# EAGLE design RGB_SMD (EAGLE 6.5.0)
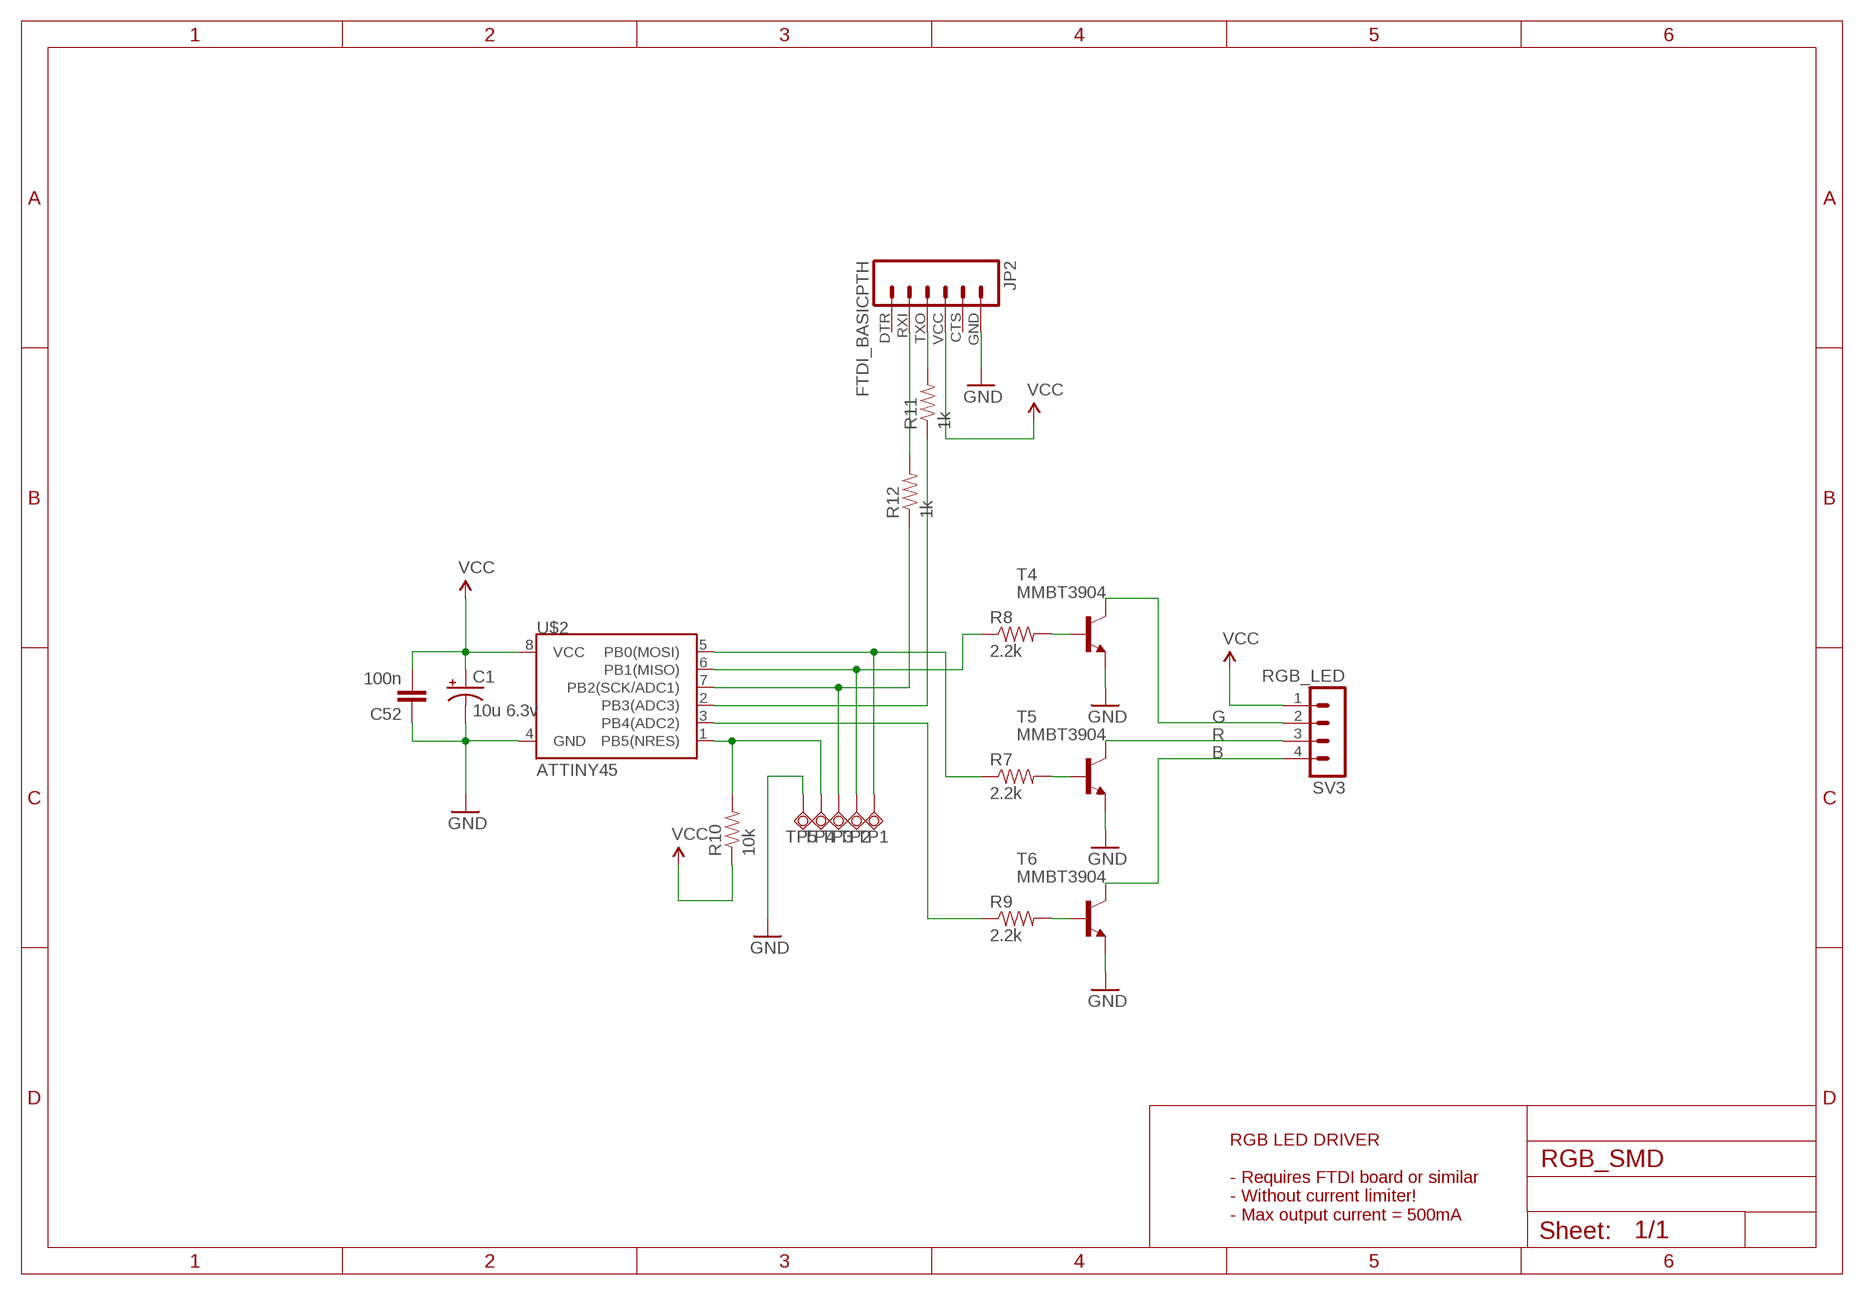
[diagram p0: schematic, sheet 1]

## Parts
C1  10u 6.3v  CAP_POL1206  [EIA3216]
C52  100n  CAP0805  [0805]
JP2  FTDI_BASICPTH  [FTDI_BASIC]
R7  2.2k  RESISTOR0805-RES  [0805]
R8  2.2k  RESISTOR0805-RES  [0805]
R9  2.2k  RESISTOR0805-RES  [0805]
R10  10k  RESISTOR0805-RES  [0805]
R11  1k  RESISTOR0805-RES  [0805]
R12  1k  RESISTOR0805-RES  [0805]
SV3  RGB_LED  MA04-1  [MA04-1]
T4  MMBT3904  MMBT3904LT1-NPN-SOT23-BEC  [SOT23-BEC]
T5  MMBT3904  MMBT3904LT1-NPN-SOT23-BEC  [SOT23-BEC]
T6  MMBT3904  MMBT3904LT1-NPN-SOT23-BEC  [SOT23-BEC]
TP1  TPSQTP16SQ  [TP16SQ]
TP2  TPSQTP16SQ  [TP16SQ]
TP3  TPSQTP16SQ  [TP16SQ]
TP4  TPSQTP16SQ  [TP16SQ]
TP5  TPSQTP16SQ  [TP16SQ]
U$2  ATTINY45  [SO08-EIAJ]

## Nets
B: SV3.4 T6.C
G: SV3.2 T4.C
GND: C1.C(-) C52.1 JP2.GND T4.E T5.E T6.E TP5.TP U$2.4(GND)
N$12: JP2.TXO R11.2
N$13: JP2.RXI R12.2
N$14: R10.2 TP4.TP U$2.1(PB5(NRES))
N$15: R11.1 U$2.2(PB3(ADC3))
N$16: R12.1 TP3.TP U$2.7(PB2(SCK/ADC1))
N$17: R7.1 TP1.TP U$2.5(PB0(MOSI))
N$18: R8.1 TP2.TP U$2.6(PB1(MISO))
N$19: R9.1 U$2.3(PB4(ADC2))
N$20: R9.2 T6.B
N$21: R7.2 T5.B
N$22: R8.2 T4.B
R: SV3.3 T5.C
VCC: C1.A(+) C52.2 JP2.VCC R10.1 SV3.1 U$2.8(VCC)
Unconnected: JP2.CTS JP2.DTR

## Notes on the sheet
- RGB LED DRIVER
  
  - Requires FTDI board or similar
  - Without current limiter!
  - Max output current = 500mA

## Library data of the parts
C1 = SparkFun:CAP_POL: Capacitor Polarized These are standard SMD and PTH capacitors. Normally 10uF, 47uF, and 100uF in electrolytic and tantalum varieties. Always verify the external diameter of the through hole cap, it varies with capacity, voltage, and manufacturer. The EIA devices should be standard.
C52 = SparkFun:CAP: Capacitor Standard 0603 ceramic capacitor, and 0.1" leaded capacitor.
JP2 = SparkFun:FTDI_BASIC: FTDI Basic: 3.3V and 5V
R7-R12 = SparkFun:RESISTOR: Resistor Basic schematic elements and footprints for 0603, 1206, and PTH resistors.
SV3 = con-lstb:MA04-1: PIN HEADER; OC_FARNELL: unknown; OC_NEWARK: unknown
T4-T6 = transistor-neu-to92:*-NPN-: NPN Transistror
TP1-TP5 = testpad:TPSQ: Test pad
U$2 = SparkFun:ATTINY45: Atmel ATTiny45

## Net classes
0 default: width 0.3 mm
4 GND: width 0.3 mm

## Board
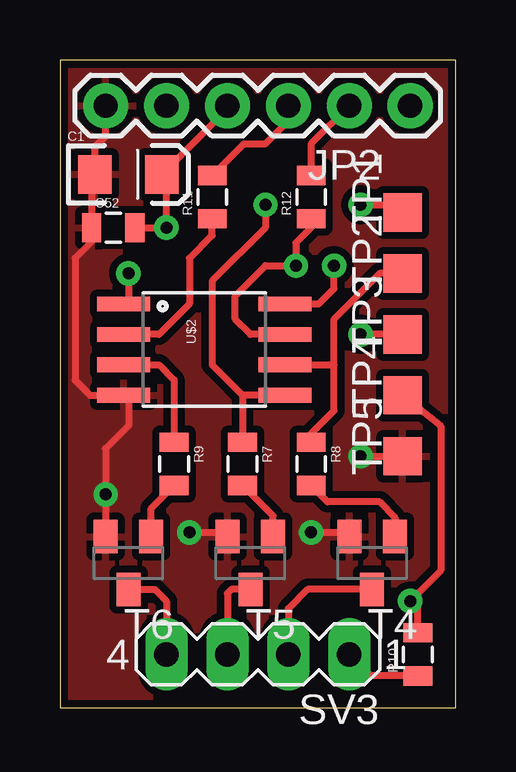
[diagram p1: board, top side]
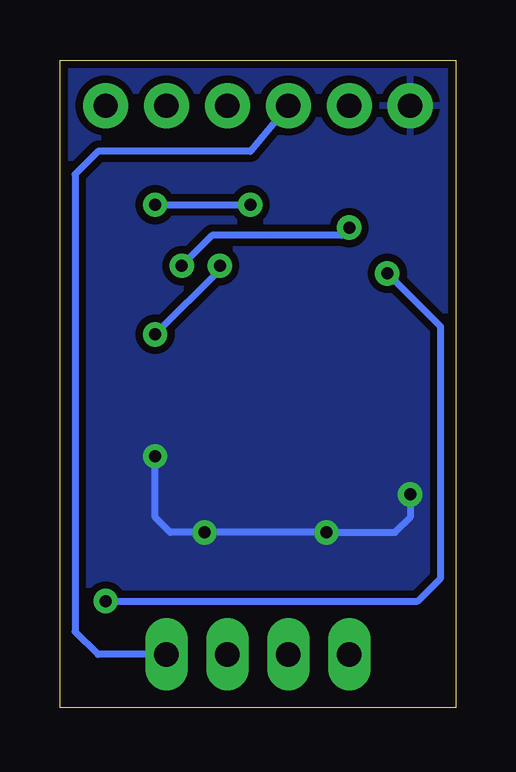
[diagram p2: board, bottom side, seen from below]

Size 16.51 x 26.99 mm. Coordinates in mm from the lower left corner, seen from the top.
Outline: 16.51,26.99 0,26.99 0,0 16.51,0 16.51,26.99
Copper layers (1*16): Top 0.035mm / dielectric 1.5mm / Bottom 0.035mm
Design rules "DROPES_fuse *": minimum track width 0.3mm, minimum drill 0.5mm, track to track 0.3mm, track to pad 0.3mm, pad to pad 0.3mm, via to via 0.3mm, smd to smd 0.3mm, copper to edge 0.3mm, drill to drill 8mil, minimum pad ring 15mil, minimum via ring 8mil, stop-mask expansion 4mil, vias tented up to drill 0mil, thermal gap 0.3mm

### Footprints (pad centres in the part's own frame; a part is rotated, then mirrored left to right if it is on the bottom)
EIA3216 = smd 1.4 x 1.6: A 1.4,0; C -1.4,0
0805 = smd 0.8 x 1.2: 1 -0.9,0; 2 0.9,0
FTDI_BASIC = drill 1.016 pad 1.88: CTS 10.16,0; DTR 0,0; GND 12.7,0; RXI 2.54,0; TXO 5.08,0; VCC 7.62,0
MA04-1 = drill 1.016 long: 1 -3.81,0; 2 -1.27,0; 3 1.27,0; 4 3.81,0
SOT23-BEC = smd 1 x 1.4: B -0.95,-1.1; C 0,1.1; E 0.95,-1.1
TP16SQ = smd 1.6 x 1.6: TP 0,0
SO08-EIAJ = smd 0.61 x 2.21: 1 -1.905,-3.378; 2 -0.635,-3.378; 3 0.635,-3.378; 4 1.905,-3.378; 5 1.905,3.353; 6 0.635,3.353; 7 -0.635,3.353; 8 -1.905,3.353

### Placement (x,y rotation side)
C1  2.86,22.23 0 top
C52  2.22,20 0 top
JP2  14.61,25.08 180 top
R7  7.62,10.16 270 top
R8  10.48,10.16 270 top
R9  4.76,10.16 270 top
R10  14.92,2.22 90 top
R11  6.35,21.27 90 top
R12  10.48,21.27 90 top
SV3  8.25,2.22 180 top
T4  13.02,6.03 180 top
T5  7.94,6.03 180 top
T6  2.86,6.03 180 top
TP1  14.29,20.64 90 top
TP2  14.29,18.1 90 top
TP3  14.29,15.56 90 top
TP4  14.29,13.02 90 top
TP5  14.29,10.48 90 top
U$2  6.03,14.92 270 top

### Tracks (layer width: path | path; a pad name or v marks a point on that pad's centre or on a via)
B
  Top 0.3: T6.C 3.96,4.93 4.44,4.45 SV3.4
G
  Top 0.3: T4.C 10.33,4.93 9.52,4.13 SV3.2
GND  (via drill 0.5 pad 1.02)
  Top 0.3: v5.4,7.3 6.67,7.3 T5.E | v10.48,7.3 11.75,7.3 T4.E | 1.59,7.3 T6.E v1.9,8.89 1.9,10.79 2.86,11.75 2.86,13.02 U$2.4 1.27,13.02 0.63,13.65 0.63,18.73 1.32,19.42 C52.1 | v12.54,10.48 TP5.TP | JP2.GND 1.89,23.8 1.46,23.36 C1.C 1.32,22.09 C52.1 | 1.26,19.75 C52.1
  Bottom 0.3: v12.54,10.48 12.54,7.94 11.91,7.3 v10.48,7.3 v5.4,7.3 2.54,7.3 1.9,7.94 v1.9,8.89
  pour Top: 0,0 0,26.99 16.51,26.99 16.51,0
  pour Bottom: 0,0 0,26.99 16.51,26.99 16.51,0
N$12
  Top 0.3: R11.2 7.67,23.49 8.57,23.49 9.52,24.45 JP2.TXO
N$13
  Top 0.3: JP2.RXI 10.48,23.49 R12.2
N$14  (via drill 0.5 pad 1.02)
  Top 0.3: TP4.TP 15.88,11.75 15.88,5.71 v14.61,4.45 14.92,4.13 R10.2 | v2.86,18.1 2.86,17.03 U$2.1
  Bottom 0.3: v14.61,4.45 1.59,4.45 0.63,5.4 0.63,15.87 v2.86,18.1
N$15
  Top 0.3: U$2.2 4.13,15.56 5.4,16.83 5.4,18.73 6.35,19.68 R11.1
N$16  (via drill 0.5 pad 1.02)
  Top 0.3: U$2.7 7.94,15.56 7.3,16.19 7.3,17.14 8.57,18.42 v9.84,18.42 9.84,19.37 10.48,20 R12.1 | TP3.TP v12.54,15.56
  Bottom 0.3: v9.84,18.42 9.84,18.26 v12.54,15.56
N$17  (via drill 0.5 pad 1.02)
  Top 0.3: 9.21,13.02 U$2.5 7.62,13.02 | 7.62,13.02 6.35,14.29 6.35,17.78 8.57,20 v8.57,20.96 | 7.62,13.02 R7.1 | v12.54,20.96 13.97,20.96 TP1.TP
  Bottom 0.3: v12.54,20.96 v8.57,20.96
N$18
  Top 0.3: U$2.6 11.43,14.29 | R8.1 10.16,11.11 11.43,12.38 11.43,14.29 | 11.43,14.29 11.43,16.19 13.33,18.1 TP2.TP
N$19
  Top 0.3: U$2.3 4.13,14.29 4.76,13.65 R9.1
N$20
  Top 0.3: T6.B 3.81,8.3 R9.2
N$21
  Top 0.3: T5.B 8.89,7.99 R7.2
N$22
  Top 0.3: 14.29,7.3 T4.B 13.97,7.94 13.33,8.57 11.16,8.57 R8.2
R
  Top 0.3: T5.C 7.15,4.93 6.98,4.76 SV3.3
VCC  (via drill 0.5 pad 1.02)
  Top 0.3: U$2.8 10.79,16.83 11.43,17.46 v11.43,18.42 | R10.1 12.96,1.32 SV3.1 | C52.2 v4.44,20 4.44,22.04 C1.A 6.98,24.95 JP2.VCC
  Bottom 0.3: JP2.VCC 8.57,23.18 14.92,23.18 15.88,22.23 15.88,3.18 14.92,2.22 SV3.1 | v11.43,18.42 10.16,19.68 4.76,19.68 v4.44,20